# EAGLE design RADIO (EAGLE 9.4.2)
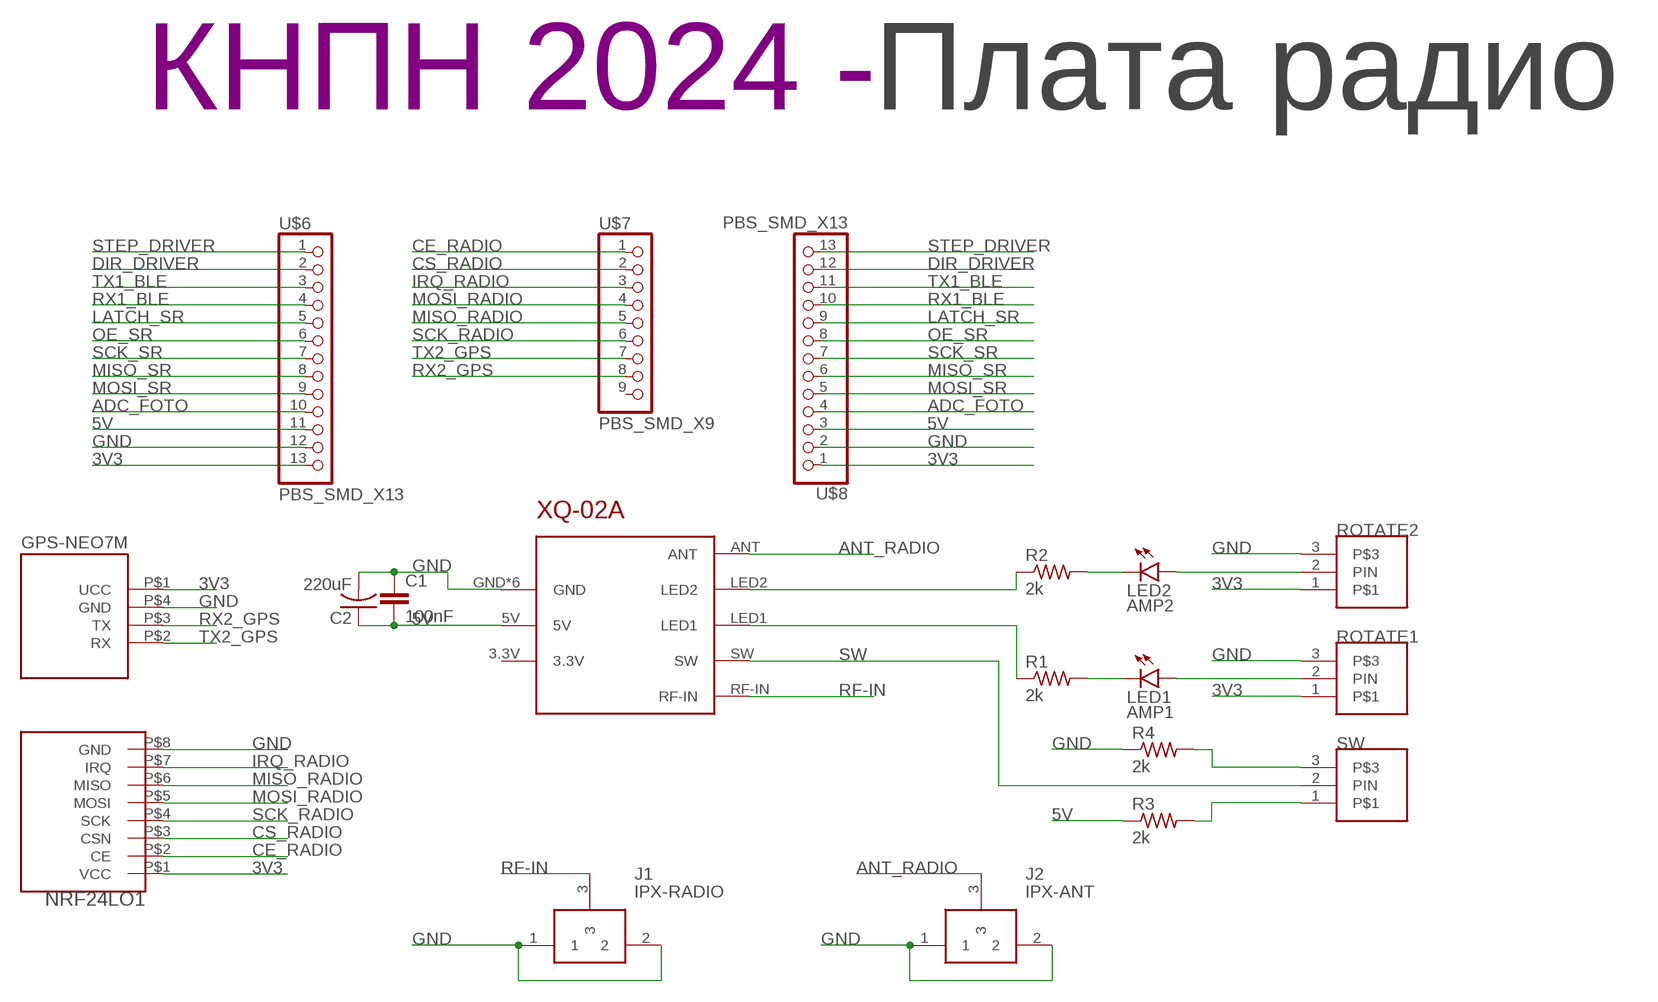
[diagram p0: schematic, sheet 1]

## Parts
C1  100nF  C-EUC0603  [C0603]
C2  220uF  ECAPECAP220  [ECAP220-CMD]
GPS-NEO7M  GPS-NEO7M  [GPS-NEO7M]
J1  IPX-RADIO  U.FL-R-SMT-1_10_  [U.FL-R-SMT-1(10)]
J2  IPX-ANT  U.FL-R-SMT-1_10_  [U.FL-R-SMT-1(10)]
LED1  AMP1  LEDCHIPLED_0603  [CHIPLED_0603]
LED2  AMP2  LEDCHIPLED_0603  [CHIPLED_0603]
NRF24LO1  NRF24L01_ML01SP4  [NRF24L01_ML01SP4]
R1  2k  R-US_R0603  [R0603]
R2  2k  R-US_R0603  [R0603]
R3  2k  R-US_R0603  [R0603]
R4  2k  R-US_R0603  [R0603]
ROTATE1  CONNECT_3  [CONNECT_3]
ROTATE2  CONNECT_3  [CONNECT_3]
SW  CONNECT_3  [CONNECT_3]
U$1  Плата радио  LOGOPCB-""  [LOGO]
U$6  PBS_SMD_X13  [PBD_SMD_X13]
U$7  PBS_SMD_X9  [PBS_SMD_X9]
U$8  PBS_SMD_X13  [PBD_SMD_X13]
XQ-02A  XQ-02A  [XQ-02A]

## Nets
3V3: GPS-NEO7M.P$1(UCC) NRF24LO1.P$1(VCC) ROTATE1.1 ROTATE2.1 U$6.13 U$8.1
5V: C1.2 C2.P$1 R3.1 U$6.11 U$8.3 XQ-02A.5V
ADC_FOTO: U$6.10 U$8.4
ANT_RADIO: J2.3 XQ-02A.ANT
CE_RADIO: NRF24LO1.P$2(CE) U$7.1
CS_RADIO: NRF24LO1.P$3(CSN) U$7.2
DIR_DRIVER: U$6.2 U$8.12
GND: C1.1 C2.P$2 GPS-NEO7M.P$4(GND) J1.1 J1.2 J2.1 J2.2 NRF24LO1.P$8(GND) R4.1 ROTATE1.3 ROTATE2.3 U$6.12 U$8.2 XQ-02A.GND XQ-02A.GND1(GND) XQ-02A.GND2(GND) XQ-02A.GND3(GND) XQ-02A.GND4(GND) XQ-02A.GND5(GND)
IRQ_RADIO: NRF24LO1.P$7(IRQ) U$7.3
LATCH_SR: U$6.5 U$8.9
MISO_RADIO: NRF24LO1.P$6(MISO) U$7.5
MISO_SR: U$6.8 U$8.6
MOSI_RADIO: NRF24LO1.P$5(MOSI) U$7.4
MOSI_SR: U$6.9 U$8.5
N$1: LED1.C R1.2
N$2: LED2.C R2.2
N$3: LED1.A ROTATE1.2(PIN)
N$4: LED2.A ROTATE2.2(PIN)
N$5: R2.1 XQ-02A.LED2
N$6: R1.1 XQ-02A.LED1
N$7: R3.2 SW.1
N$8: R4.2 SW.3
OE_SR: U$6.6 U$8.8
RF-IN: J1.3 XQ-02A.RF-IN
RX1_BLE: U$6.4 U$8.10
RX2_GPS: GPS-NEO7M.P$3(TX) U$7.8
SCK_RADIO: NRF24LO1.P$4(SCK) U$7.6
SCK_SR: U$6.7 U$8.7
STEP_DRIVER: U$6.1 U$8.13
SW: SW.2(PIN) XQ-02A.SW
TX1_BLE: U$6.3 U$8.11
TX2_GPS: GPS-NEO7M.P$2(RX) U$7.7
Unconnected: U$7.9 XQ-02A.3.3V

## Library data of the parts
C1 = rcl:C-EU: CAPACITOR, European symbol; SPICEPREFIX: C
C2 = UNKNOWN-2024:ECAP
GPS-NEO7M = UNKNOWN-2024:GPS-NEO7M
J1 J2 = UNKNOWN-2024:U.FL-R-SMT-1_10_: UFL SMT PCB receptable,DC-6GHz Hirose Straight 50 Surface Mount UFL Connector, Receptacle, Solder Termination Coaxial Source: Datasheet <https://www.hirose.com/product/document?clcode=CL0331-0472-2-10&productname=U.FL-R-SMT-1(10)&series=U.FL&documenttype=2DDrawing&lang=en&documentid=0000940684>; ARROW_PART_NUMBER: U.FL-R-SMT-1(10); ARROW_PRICE-STOCK: https://www.arrow.com/en/products/u.fl-r-smt-1-10/hirose-electric; DESCRIPTION: UFL SMT PCB receptable,DC-6GHz Hirose Straight 50 Surface Mount UFL Connector, Receptacle, Solder Termination Coaxial; HEIGHT: mm; MANUFACTURER_NAME: Hirose; MANUFACTURER_PART_NUMBER: U.FL-R-SMT-1(10); MOUSER_PART_NUMBER: 798-U.FL-R-SMT-110; MOUSER_PRICE-STOCK: https://www.mouser.co.uk/ProductDetail/Hirose-Connector/U.FL-R-SMT-110?qs=kL1ClTr6oBoOdtqlGQpQrQ%3D%3D
LED1 LED2 = led:LED: LED OSRAM: - CHIPLED LG R971, LG N971, LY N971, LG Q971, LY Q971, LO R971, LY R971 LH N974, LH R974 LS Q976, LO Q976, LY Q976 LO Q996 - Hyper CHIPLED LW Q18S LB Q993, LB Q99A, LB R99A - SideLED LS A670, LO A670, LY A670, LG A670, LP A670 LB A673, LV A673, LT A673, LW A673 LH A674 LY A675 LS A676, LA A676, LO A676, LY A676, LW A676 LS A679, LY A679, LG A679 - Hyper Micro SIDELED® LS Y876, LA Y876, LO Y876, LY Y876 LT Y87S - SmartLED LW L88C, LW L88S LB L89C, LB L89S, LG L890 LS L89K, LO L89K, LY L89K LS L896, LA L896, LO L896, LY L896 - TOPLED LS T670, LO T670, LY T670, LG T670, LP T670 LSG T670, LSP T670, LSY T670, LOP T670, LYG T670 LG T671, LOG T671, LSG T671 LB T673, LV T673, LT T673, LW T673 LH T674 LS T676, LA T676, LO T676, LY T676, LB T676, LH T676, LSB T676, LW T676 LB T67C, LV T67C, LT T67C, LS T67K, LO T67K, LY T67K, LW E67C LS E67B, LA E67B, LO E67B, LY E67B, LB E67C, LV E67C, LT E67C LW T67C LS T679, LY T679, LG T679 LS T770, LO T770, LY T770, LG T770, LP T770 LB T773, LV T773, LT T773, LW T773 LH T774 LS E675, LA E675, LY E675, LS T675 LS T776, LA T776, LO T776, LY T776, LB T776 LHGB T686 LT T68C, LB T68C - Hyper Mini TOPLED® LB M676 - Mini TOPLED Santana® LG M470 LS M47K, LO M47K, LY M47K Source: http://www.osram.convergy.de LUXEON: - LUMILED® LXK2-PW12-R00, LXK2-PW12-S00, LXK2-PW14-U00, LXK2-PW14-V00 LXK2-PM12-R00, LXK2-PM12-S00, LXK2-PM14-U00 LXK2-PE12-Q00, LXK2-PE12-R00, LXK2-PE12-S00, LXK2-PE14-T00, LXK2-PE14-U00 LXK2-PB12-K00, LXK2-PB12-L00, LXK2-PB12-M00, LXK2-PB14-N00, LXK2-PB14-P00, LXK2-PB14-Q00 LXK2-PR12-L00, LXK2-PR12-M00, LXK2-PR14-Q00, LXK2-PR14-R00 LXK2-PD12-Q00, LXK2-PD12-R00, LXK2-PD12-S00 LXK2-PH12-R00, LXK2-PH12-S00 LXK2-PL12-P00, LXK2-PL12-Q00, LXK2-PL12-R00 Source: www.luxeon.com KINGBRIGHT: KA-3528ASYC Source: www.kingbright.com
NRF24LO1 = UNKNOWN-2024:NRF24L01_ML01SP4
R1-R4 = rcl:R-US_: RESISTOR, American symbol; SPICEPREFIX: R
ROTATE1 ROTATE2 SW = UNKNOWN-2024:CONNECT_3
U$1 = UNKNOWN-2024:LOGO
U$6 U$8 = UNKNOWN-2024:PBS_SMD_X13
U$7 = UNKNOWN-2024:PBS_SMD_X9
XQ-02A = UNKNOWN-2024:XQ-02A

## Board
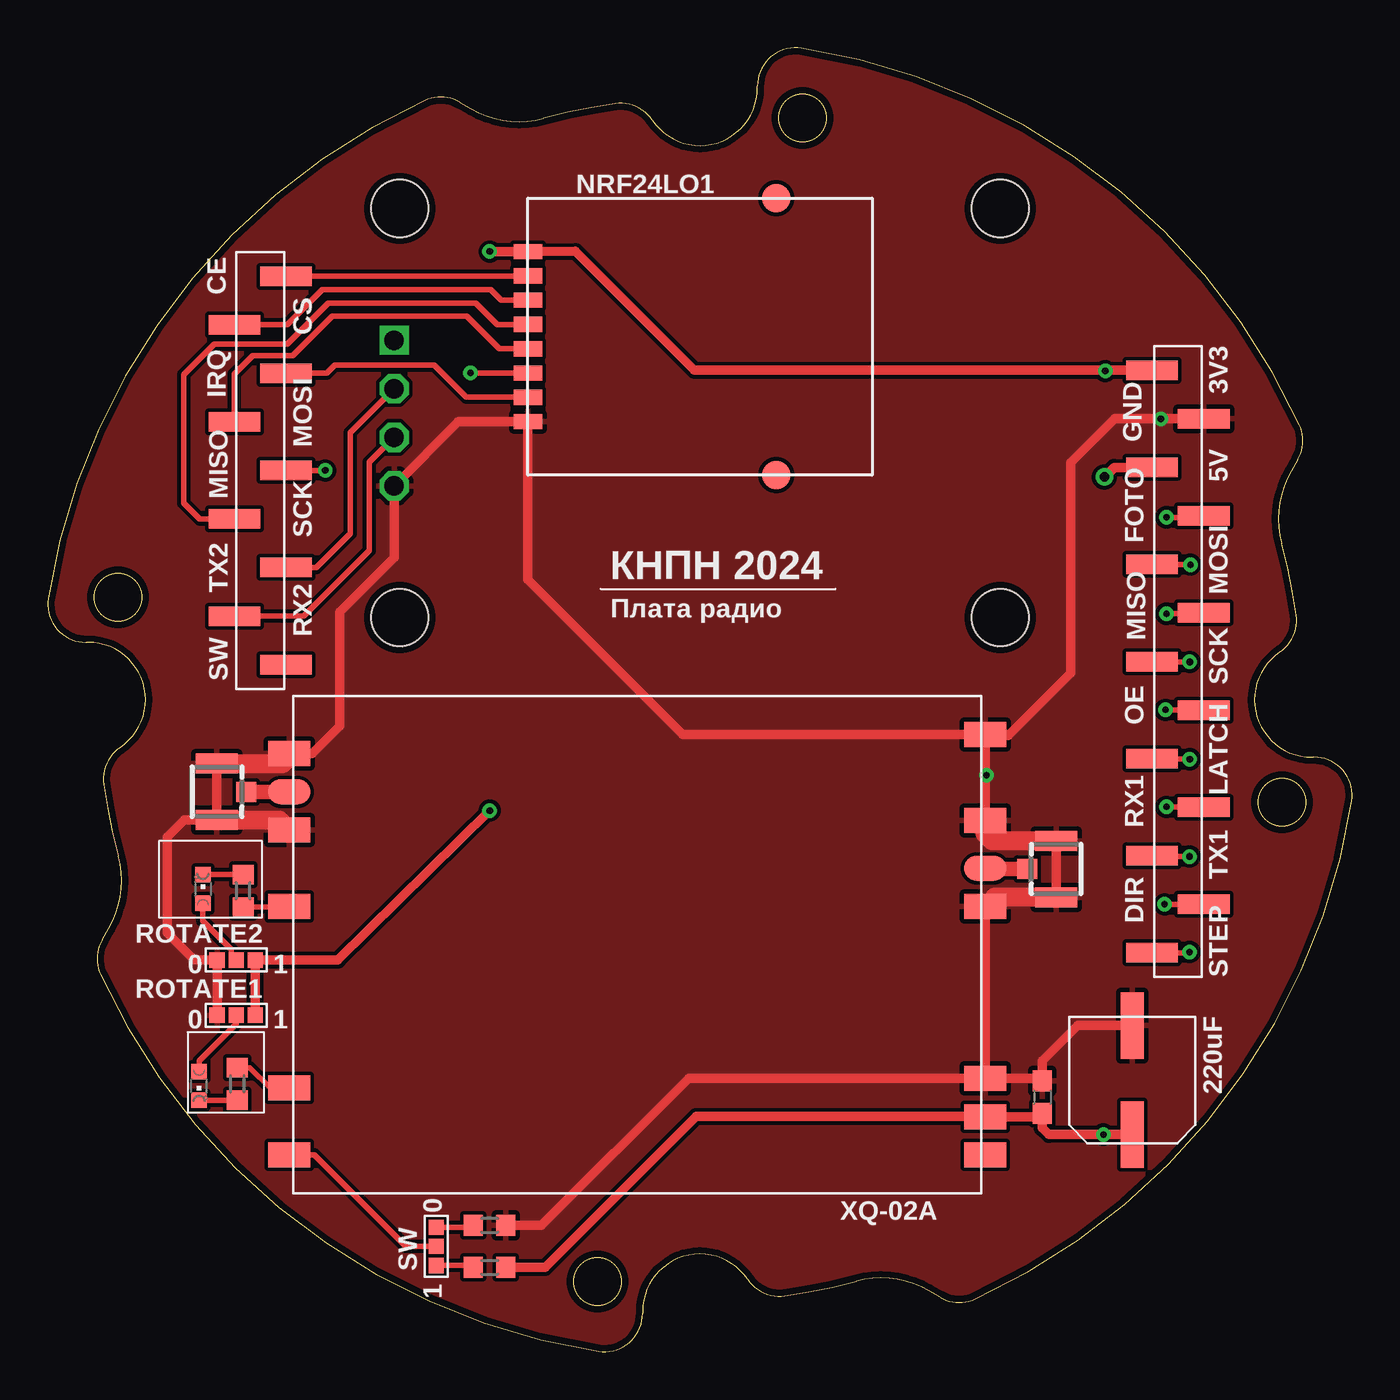
[diagram p1: board, top side]
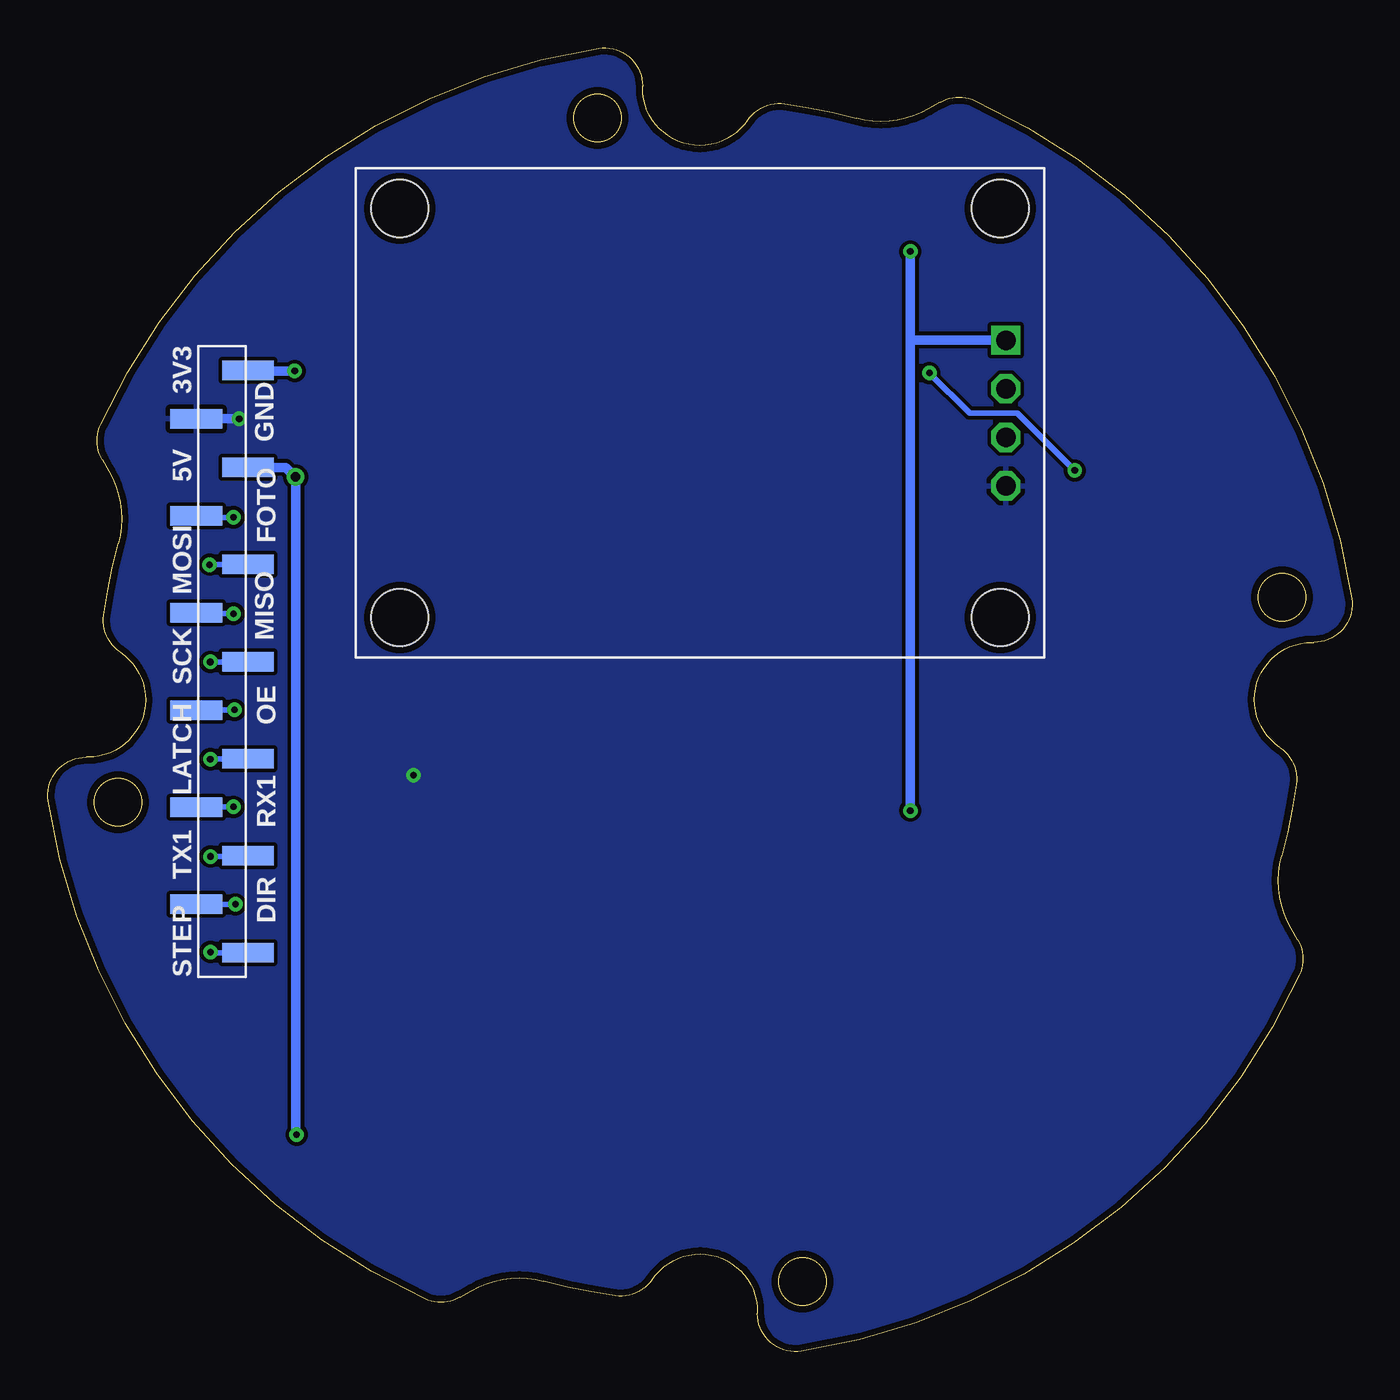
[diagram p2: board, bottom side, seen from below]

Size 68.22 x 68.22 mm. Coordinates in mm from the lower left corner, seen from the top.
Outline: 2.84,21.55 3.19,22.15 arc45 3.69,25.95 arc-7 2.92,29.68 arc-64 3.79,31.62 arc146 2.11,37.11 2,37.11 arc-99 0.02,39.42 arc-56 19.72,65.47 arc-55 21.55,65.38 22.15,65.03 arc45 25.95,64.54 arc-7 29.68,65.3 arc-64 31.62,64.44 arc146 37.11,66.11 37.11,66.22 arc-99 39.42,68.2 arc-56 65.47,48.5 arc-55 65.38,46.67 65.03,46.07 arc45 64.54,42.28 arc-7 65.3,38.54 arc-64 64.44,36.6 arc146 66.11,31.11 66.22,31.11 arc-99 68.2,28.8 arc-56 48.5,2.76 arc-55 46.67,2.84 46.07,3.19 arc45 42.28,3.69 arc-7 38.54,2.92 arc-64 36.6,3.79 arc146 31.11,2.11 31.11,2 arc-99 28.8,0.02 arc-56 2.76,19.72 arc-55 2.84,21.55
Outline: circle at 64.54,28.75 radius 1.25
Outline: circle at 28.75,3.68 radius 1.25
Outline: circle at 3.68,39.48 radius 1.25
Outline: circle at 39.48,64.54 radius 1.25
Copper layers (1*16): Top 0.035mm / dielectric 1.5mm / Bottom 0.035mm
Design rules "default *": minimum track width 0.3mm, minimum drill 0.35mm, track to track 0.2mm, track to pad 0.2mm, pad to pad 0.2mm, via to via 0.2mm, smd to smd 0.2mm, copper to edge 0.35mm, drill to drill 0.2mm, minimum pad ring 10mil, minimum via ring 8mil, stop-mask expansion 4mil, vias tented up to drill 0mil, thermal gap 10mil

### Footprints (pad centres in the part's own frame; a part is rotated, then mirrored left to right if it is on the bottom)
C0603 = smd 1.1 x 1: 1 -0.85,0; 2 0.85,0
ECAP220-CMD = smd 1.2 x 3.5: P$1 0,2.85; P$2 0,-2.85
GPS-NEO7M = drill 1.016 square: P$1 -3.81,16 | drill 1.016 octagon: P$2 -1.27,16; P$3 1.27,16; P$4 3.81,16 | hole 3: -10.7,15.7; 10.7,15.7; 10.7,-15.7; -10.7,-15.7
U.FL-R-SMT-1(10) = smd 1.05 x 2.2: 1 -1.475,0; 2 1.475,0 | smd 1.05 x 1.05: 3 0,1.525
CHIPLED_0603 = smd 0.8 x 0.8: A 0,-0.75; C 0,0.75
NRF24L01_ML01SP4 = smd 1.5 x 0.8: P$1 -9,4.445; P$2 -9,3.175; P$3 -9,1.905; P$4 -9,0.635; P$5 -9,-0.635; P$6 -9,-1.905; P$7 -9,-3.175; P$8 -9,-4.445 | smd 1.5 x 1.5: P$9 4,7.25; P$10 4,-7.25
R0603 = smd 1 x 1.1: 1 -0.85,0; 2 0.85,0
CONNECT_3 = smd 0.8 x 0.8: 1 1,0; 2 0,0; 3 -1,0
PBD_SMD_X13 = smd 1.02 x 2.7: 1 -15.24,1.35; 2 -12.7,-1.35; 3 -10.16,1.35; 4 -7.62,-1.35; 5 -5.08,1.35; 6 -2.54,-1.35; 7 0,1.35; 8 2.54,-1.35; 9 5.08,1.35; 10 7.62,-1.35; 11 10.16,1.35; 12 12.7,-1.35; 13 15.24,1.35
PBS_SMD_X9 = smd 1.02 x 2.7: 1 -10.16,1.35; 2 -7.62,-1.35; 3 -5.08,1.35; 4 -2.54,-1.35; 5 0,1.35; 6 2.54,-1.35; 7 5.08,1.35; 8 7.62,-1.35; 9 10.16,1.35
XQ-02A = smd 2.2 x 1.3: 3.3V -18.2,11; 5V -18.2,9; ANT 18.2,-8; GND -18.2,7; GND1 -18.2,-2; GND2 -18.2,-6.5; GND3 -18.2,-11; GND4 18.2,-6; GND5 18.2,-10; LED1 18.2,7.5; LED2 18.2,-2; RF-IN -18.2,-4; SW 18.2,11

### Placement (x,y rotation side)
C1  52.01,13.31 270 top
C2  56.71,14.21 180 top
GPS-NEO7M  34.11,49.11 270 bottom
J1  52.75,25.25 90 top
J2  8.85,29.3 270 top
LED1  7.91,13.91 180 top
LED2  8.11,24.21 0 top
NRF24LO1  34.11,53.11 0 top
R1  9.91,14.01 270 top
R2  10.21,24.11 90 top
R3  23.11,4.41 180 top
R4  23.11,6.61 180 top
ROTATE1  9.85,17.61 0 top
ROTATE2  9.85,20.49 0 top
SW  20.31,5.51 270 top
U$1  28.91,39.91 0 top
U$6  59.11,36.11 90 top
U$7  11.11,46.11 270 top
U$8  59.11,36.11 270 bottom
XQ-02A  30.83,21.3 180 top

### Tracks (layer width: path | path; a pad name or v marks a point on that pad's centre or on a via)
3V3  (via drill 0.35)
  Top 0.5: ROTATE1.1 ROTATE2.1 15.17,20.49 v23.11,28.31 | v23.11,57.56 NRF24LO1.P$1 27.59,57.58 33.81,51.35 55.27,51.35 v55.31,51.31 55.35,51.35 U$8.1
  Bottom 0.5: v55.31,51.31 57.72,51.31 U$8.1 | v23.11,57.56 23.11,52.92 | GPS-NEO7M.P$1 23.11,52.92 | 23.11,52.92 v23.11,28.31
5V  (via drill 0.35, 0.5)
  Top 0.5: v55.26,45.77 55.77,46.27 U$8.3 | C2.P$1 v55.21,11.36 52.36,11.36 52.01,11.71 C1.2 51.85,12.3 XQ-02A.5V 49.02,12.31 33.91,12.31 26.01,4.41 R3.1
  Bottom 0.5: U$8.3 55.77,46.27 v55.26,45.77 55.26,11.41 v55.21,11.36
ADC_FOTO  (via drill 0.35)
  Top 0.3: U$8.4 60.39,43.66 v58.51,43.66
  Bottom 0.3: U$8.4 60.39,43.66 v58.51,43.66
ANT_RADIO
  Top 0.75: J2.3 XQ-02A.ANT
CE_RADIO
  Top 0.3: U$7.1 25.45,56.27 NRF24LO1.P$2
CS_RADIO
  Top 0.3: U$7.2 12.53,53.73 14.37,55.57 23.16,55.57 23.71,55.02 NRF24LO1.P$3
DIR_DRIVER  (via drill 0.35)
  Top 0.3: v58.41,23.41 U$8.12
  Bottom 0.3: U$8.12 v58.41,23.41
GND  (via drill 0.35)
  Top 0.3: XQ-02A.GND3 49.1,32.23 | 49.1,32.23 v49.1,30.16 49.1,27.86 XQ-02A.GND2 | 50.23,32.23 49.1,32.23
  Top 0.5: XQ-02A.GND5 12.81,31.3 13.83,31.3 15.26,32.73 15.26,38.71 18.11,41.56 GPS-NEO7M.P$4 21.48,48.67 NRF24LO1.P$8 25.11,40.4 33.21,32.3 XQ-02A.GND3 | XQ-02A.GND3 XQ-02A.GND2 | J1.2 J1.1 | ROTATE1.3 ROTATE2.3 7.65,20.49 6.25,21.9 6.25,26.92 7.15,27.82 J2.2 J2.1 | XQ-02A.GND3 50.17,32.3 50.23,32.23 53.51,35.51 53.51,46.51 55.81,48.81 v58.21,48.81 U$8.2 | XQ-02A.GND1 XQ-02A.GND | XQ-02A.GND 51.88,14.3 C1.1 52.01,15.21 53.86,17.06 C2.P$2 | R4.1 25.81,6.61 33.51,14.31 49.02,14.31 XQ-02A.GND
  Top 1: J1.2 49.39,26.73 49.01,27.11 49.01,27.77 49.1,27.86 | J1.1 49.52,23.78 XQ-02A.GND1 | J2.1 12.29,30.77 12.63,31.12 | 12.63,31.12 12.81,31.3 | XQ-02A.GND5 12.63,31.12 | J2.2 12.11,27.82 XQ-02A.GND4
  Bottom 0.5: v58.21,48.81 U$8.2
  pour Top: -14.89,75.11 81.11,75.11 81.11,-1.89 -14.89,-1.89
  pour Bottom: -15.89,76.11 82.11,76.11 82.11,-2.89 -15.89,-2.89
IRQ_RADIO
  Top 0.3: U$7.3 14.59,51.19 15.01,51.61 20.21,51.61 21.89,49.94 NRF24LO1.P$7
LATCH_SR  (via drill 0.35)
  Top 0.3: v59.73,31 57.79,31 U$8.9
  Bottom 0.3: v59.73,31 57.79,31 U$8.9
MISO_RADIO  (via drill 0.35)
  Top 0.3: v14.51,46.11 U$7.5 | NRF24LO1.P$6 v22.11,51.21
  Bottom 0.3: v22.11,51.21 20.01,49.11 17.51,49.11 v14.51,46.11
MISO_SR  (via drill 0.35)
  Top 0.3: U$8.6 60.42,38.61 v58.51,38.61
  Bottom 0.3: U$8.6 60.42,38.61 v58.51,38.61
MOSI_RADIO
  Top 0.3: U$7.4 9.76,51.15 10.72,52.11 12.82,52.11 14.88,54.18 21.91,54.18 23.61,52.48 NRF24LO1.P$5
MOSI_SR  (via drill 0.35)
  Top 0.3: U$8.5 57.78,41.18 v59.76,41.18
  Bottom 0.3: v59.76,41.18 57.78,41.18 U$8.5
N$1
  Top 0.3: LED1.C R1.2
N$2
  Top 0.3: LED2.C R2.2
N$3
  Top 0.3: ROTATE1.2 9.85,17.15 7.91,15.21 LED1.A
N$4
  Top 0.3: ROTATE2.2 9.6,20.74 9.6,21.04 8.11,22.53 LED2.A
N$5
  Top 0.3: R2.1 12.6,23.26 XQ-02A.LED2
N$6
  Top 0.3: R1.1 10.56,14.86 11.63,13.8 XQ-02A.LED1
N$7
  Top 0.3: SW.1 22.16,4.51 R3.2
N$8
  Top 0.3: SW.3 22.16,6.51 R4.2
OE_SR  (via drill 0.35)
  Top 0.3: U$8.8 60.45,33.58 v58.46,33.58
  Bottom 0.3: U$8.8 60.45,33.58 v58.46,33.58
RF-IN
  Top 0.75: J1.3 49.07,25.25 XQ-02A.RF-IN
RX1_BLE  (via drill 0.35)
  Top 0.3: U$8.10 60.44,28.51 v58.51,28.51
  Bottom 0.3: U$8.10 60.44,28.51 v58.51,28.51
RX2_GPS
  Top 0.3: GPS-NEO7M.P$3 16.81,46.54 16.81,41.91 13.39,38.49 U$7.8
SCK_RADIO
  Top 0.3: U$7.6 7.95,43.57 7.11,44.41 7.11,51.11 8.71,52.71 12.51,52.71 14.67,54.87 22.38,54.87 23.5,53.75 NRF24LO1.P$4
SCK_SR  (via drill 0.35)
  Top 0.3: v59.72,36.09 57.78,36.09 U$8.7
  Bottom 0.3: v59.72,36.09 57.78,36.09 U$8.7
STEP_DRIVER  (via drill 0.35)
  Top 0.3: U$8.13 59.67,20.87 v59.71,20.91
  Bottom 0.3: v59.71,20.91 59.67,20.87 U$8.13
SW
  Top 0.3: XQ-02A.SW 13.93,10.3 18.71,5.51 SW.2
TX1_BLE  (via drill 0.35)
  Top 0.3: v59.71,25.91 57.8,25.91 U$8.11
  Bottom 0.3: v59.71,25.91 57.8,25.91 U$8.11
TX2_GPS
  Top 0.3: GPS-NEO7M.P$2 15.81,48.08 15.81,42.81 14.03,41.03 U$7.7

### Text on the board
tNames: CE | CS | IRQ | 3V3 | GND | MOSI | 5V | MISO | SCK | FOTO | TX2 | MOSI | RX2 | MISO | SW | SCK | OE | LATCH | RX1 | TX1 | DIR | STEP
bNames: 3V3 | GND | 5V | FOTO | MOSI | MISO | SCK | OE | LATCH | RX1 | TX1 | DIR | STEP